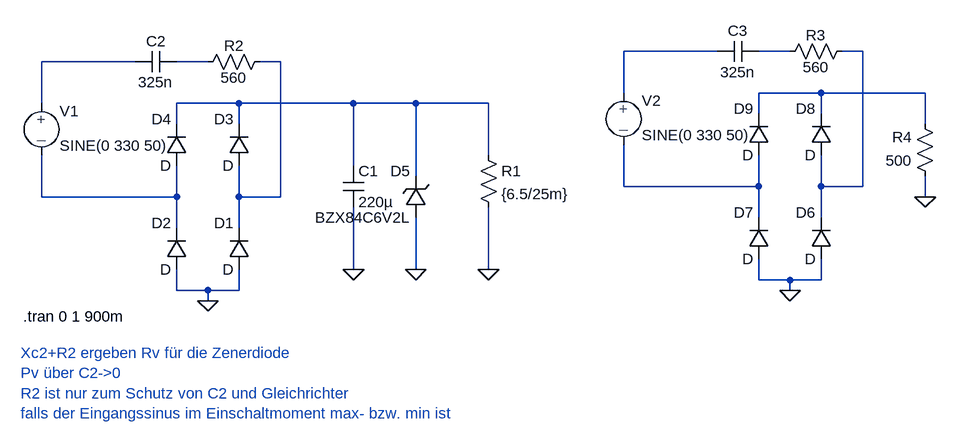
[diagram p0: schematic Zenerstabilisierung_230V_Netz.asc]
Zenerstabilisierung_230V_Netz.asc, the LTspice schematic file:
Version 4
SHEET 1 1268 680
WIRE 928 -64 784 -64
WIRE 1040 -64 992 -64
WIRE 1152 -64 1120 -64
WIRE 32 -48 -112 -48
WIRE 144 -48 96 -48
WIRE 256 -48 224 -48
WIRE 784 0 784 -64
WIRE 1088 0 992 0
WIRE 1248 0 1088 0
WIRE -112 16 -112 -48
WIRE 192 16 96 16
WIRE 368 16 192 16
WIRE 464 16 368 16
WIRE 576 16 464 16
WIRE 992 32 992 0
WIRE 1088 32 1088 0
WIRE 96 48 96 16
WIRE 192 48 192 16
WIRE 1248 48 1248 0
WIRE 576 96 576 16
WIRE 368 112 368 16
WIRE 464 128 464 16
WIRE 784 144 784 80
WIRE 992 144 992 96
WIRE 992 144 784 144
WIRE 1088 144 1088 96
WIRE 1152 144 1152 -64
WIRE 1152 144 1088 144
WIRE -112 160 -112 96
WIRE 96 160 96 112
WIRE 96 160 -112 160
WIRE 192 160 192 112
WIRE 256 160 256 -48
WIRE 256 160 192 160
WIRE 1248 160 1248 128
WIRE 992 192 992 144
WIRE 1088 192 1088 144
WIRE 96 208 96 160
WIRE 192 208 192 160
WIRE 368 272 368 176
WIRE 464 272 464 192
WIRE 576 272 576 176
WIRE 992 288 992 256
WIRE 1040 288 992 288
WIRE 1088 288 1088 256
WIRE 1088 288 1040 288
WIRE 96 304 96 272
WIRE 144 304 96 304
WIRE 192 304 192 272
WIRE 192 304 144 304
WIRE 1040 304 1040 288
WIRE 144 320 144 304
FLAG 144 320 0
FLAG 576 272 0
FLAG 464 272 0
FLAG 368 272 0
FLAG 1040 304 0
FLAG 1248 160 0
SYMBOL source-V -112 0 R0
WINDOW 123 0 0 Left 0
WINDOW 39 0 0 Left 0
SYMATTR InstName V1
SYMATTR Value SINE(0 330 50)
SYMBOL diode 208 272 R180
WINDOW 0 24 72 Left 0
WINDOW 3 24 0 Left 0
SYMATTR InstName D1
SYMBOL diode 112 272 R180
WINDOW 0 24 72 Left 0
WINDOW 3 24 0 Left 0
SYMATTR InstName D2
SYMBOL diode 208 112 R180
WINDOW 0 24 72 Left 0
WINDOW 3 24 0 Left 0
SYMATTR InstName D3
SYMBOL diode 112 112 R180
WINDOW 0 24 72 Left 0
WINDOW 3 24 0 Left 0
SYMATTR InstName D4
SYMBOL res 560 80 R0
SYMATTR InstName R1
SYMATTR Value {6.5/25m}
SYMBOL cap 352 112 R0
SYMATTR InstName C1
SYMATTR Value 220µ
SYMBOL zener 480 192 R180
WINDOW 0 24 72 Left 0
WINDOW 3 24 0 Left 0
SYMATTR InstName D5
SYMATTR Value BZX84C6V2L
SYMBOL res 240 -64 R90
WINDOW 0 7 56 VBottom 0
WINDOW 3 25 56 VTop 0
SYMATTR InstName R2
SYMATTR Value 560
SYMBOL cap 96 -64 R90
WINDOW 0 0 32 VBottom 0
WINDOW 3 32 32 VTop 0
SYMATTR InstName C2
SYMATTR Value 325n
SYMBOL source-V 784 -16 R0
WINDOW 123 0 0 Left 0
WINDOW 39 0 0 Left 0
SYMATTR InstName V2
SYMATTR Value SINE(0 330 50)
SYMBOL diode 1104 256 R180
WINDOW 0 24 72 Left 0
WINDOW 3 24 0 Left 0
SYMATTR InstName D6
SYMBOL diode 1008 256 R180
WINDOW 0 24 72 Left 0
WINDOW 3 24 0 Left 0
SYMATTR InstName D7
SYMBOL diode 1104 96 R180
WINDOW 0 24 72 Left 0
WINDOW 3 24 0 Left 0
SYMATTR InstName D8
SYMBOL diode 1008 96 R180
WINDOW 0 24 72 Left 0
WINDOW 3 24 0 Left 0
SYMATTR InstName D9
SYMBOL res 1136 -80 R90
WINDOW 0 7 56 VBottom 0
WINDOW 3 25 56 VTop 0
SYMATTR InstName R3
SYMATTR Value 560
SYMBOL cap 992 -80 R90
WINDOW 0 0 32 VBottom 0
WINDOW 3 32 32 VTop 0
SYMATTR InstName C3
SYMATTR Value 325n
SYMBOL res 1264 144 R180
WINDOW 0 36 76 Left 0
WINDOW 3 36 40 Left 0
SYMATTR InstName R4
SYMATTR Value 500
TEXT -140 344 Left 0 !.tran 0 1 900m
TEXT -144 400 Left 0 ;Xc2+R2 ergeben Rv für die Zenerdiode\nPv über C2->0\nR2 ist nur zum Schutz von C2 und Gleichrichter \nfalls der Eingangssinus im Einschaltmoment max- bzw. min ist

The netlist it stands for:
* Zenerstabilisierung_230V_Netz.asc
V1 N004 N010 SINE(0 330 50)
D1 0 N006 D
D2 0 N010 D
D3 N006 N008 D
D4 N010 N008 D
R1 N008 0 {6.5/25m}
C1 N008 0 220µ
D5 0 N008 BZX84C6V2L
R2 N006 N005 560
C2 N005 N004 325n
V2 N001 N009 SINE(0 330 50)
D6 0 N003 D
D7 0 N009 D
D8 N003 N007 D
D9 N009 N007 D
R3 N003 N002 560
C3 N002 N001 325n
R4 0 N007 500
.model D D
.lib standard.dio
.tran 0 1 900m
* Xc2+R2 ergeben Rv für die Zenerdiode
* Pv über C2->0
* R2 ist nur zum Schutz von C2 und Gleichrichter
* falls der Eingangssinus im Einschaltmoment max- bzw. min ist
.backanno
.end